# EAGLE design main (EAGLE 6.5.0)
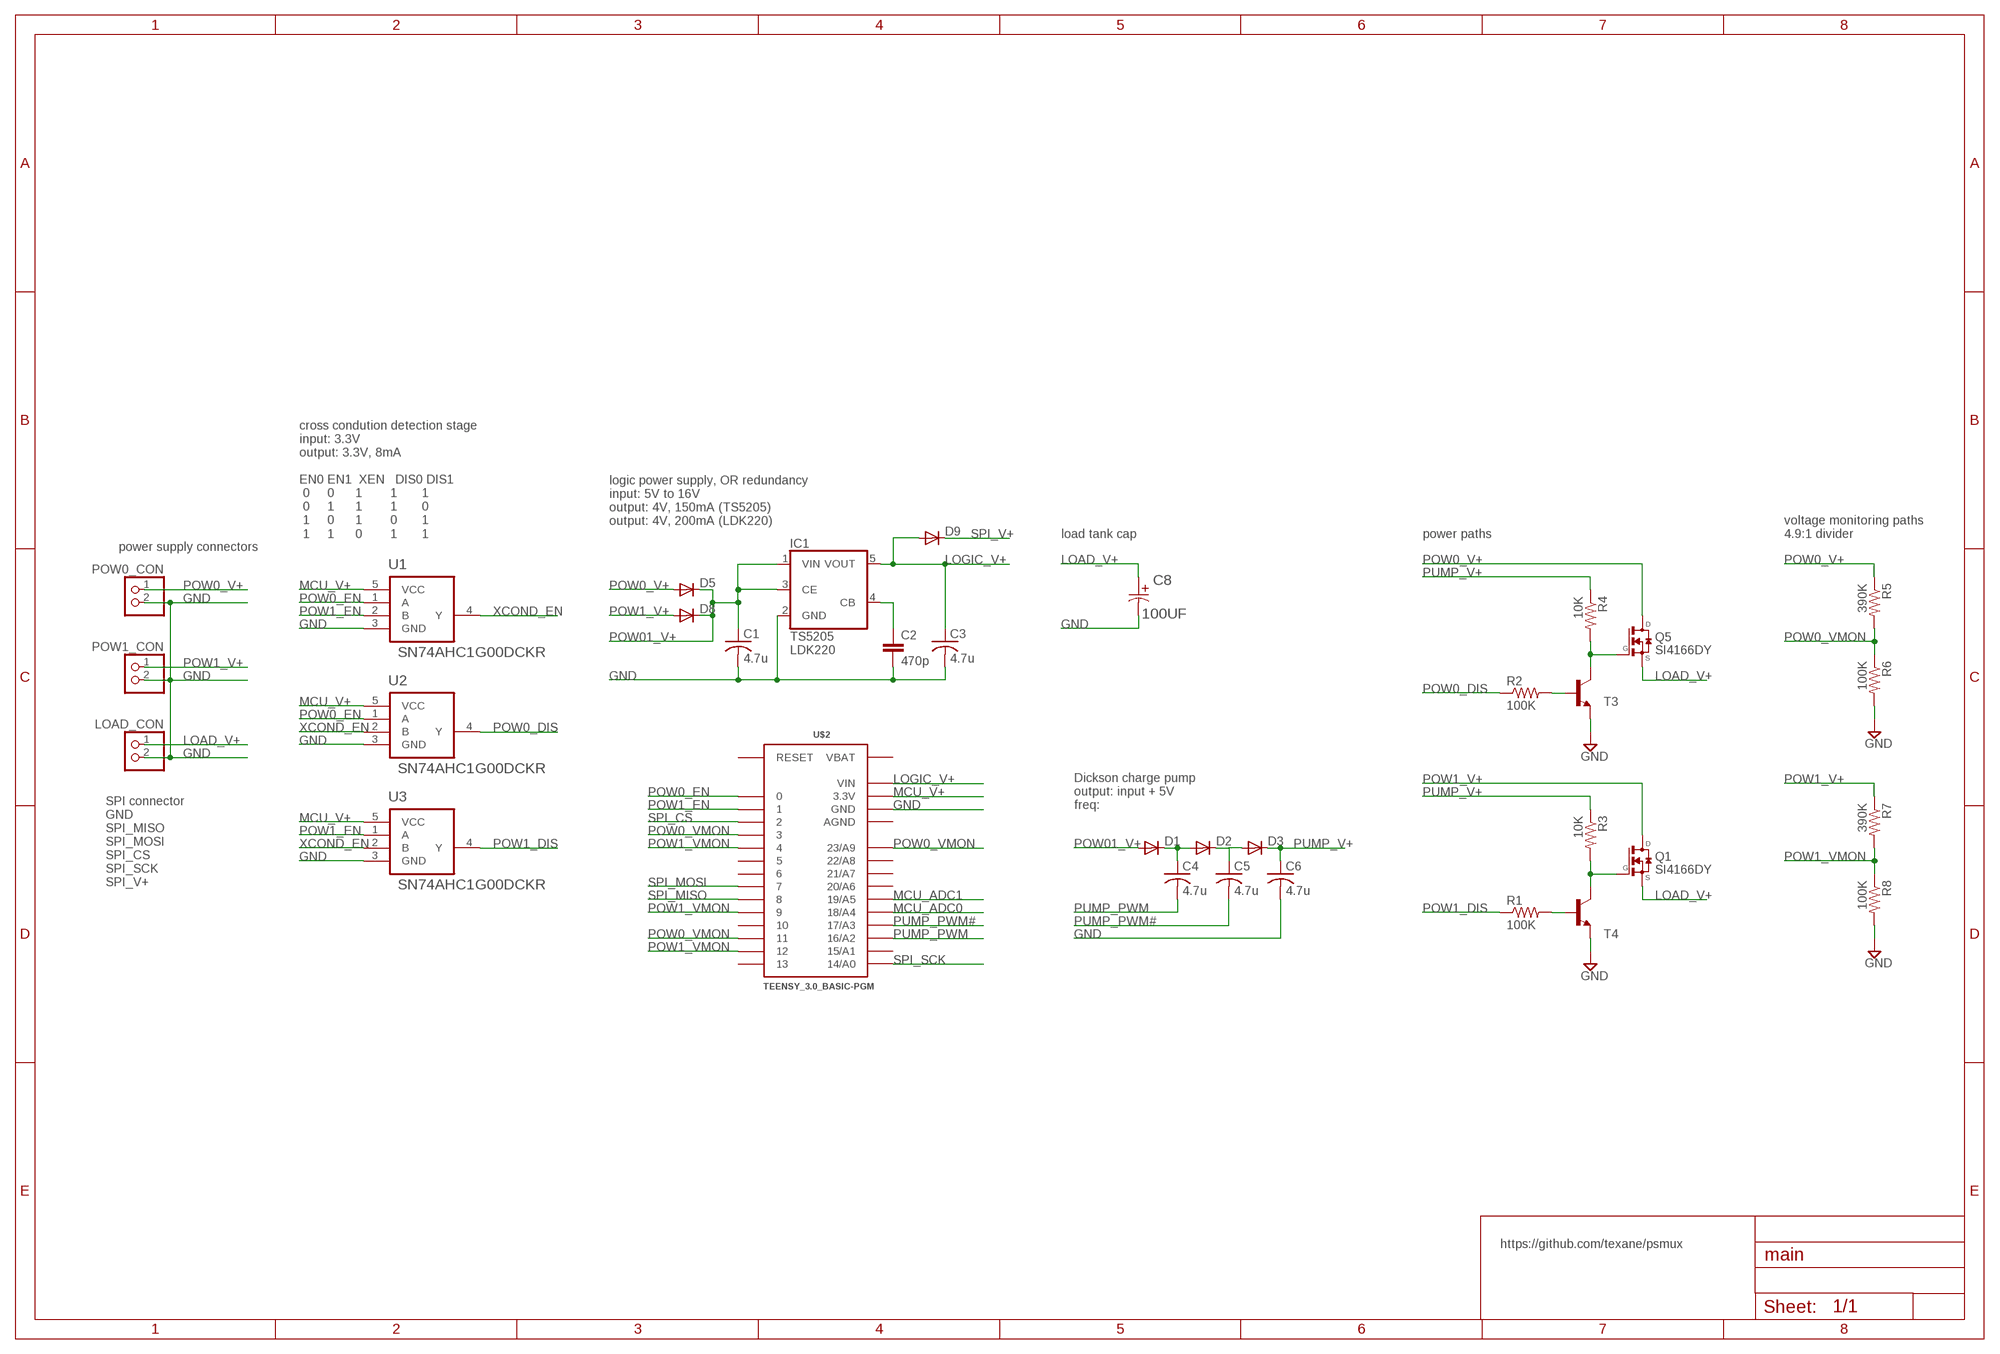
[diagram p0: schematic, sheet 1]

## Parts
C1  4.7u  C-USC1210K  [C1210K]
C2  470p  C-EUC0805K  [C0805K]
C3  4.7u  C-USC1210K  [C1210K]
C4  4.7u  C-USC1210K  [C1210K]
C5  4.7u  C-USC1210K  [C1210K]
C6  4.7u  C-USC1210K  [C1210K]
C8  100UF  EEE-FK1E101XP-CASE-D8  [CAPAE660X800N]
D1  DIODE-DO214AC  [DO214AC]
D2  DIODE-DO214AC  [DO214AC]
D3  DIODE-DO214AC  [DO214AC]
D5  DIODE-DO214AC  [DO214AC]
D8  DIODE-DO214AC  [DO214AC]
D9  DIODE-DO214AC  [DO214AC]
IC1  TS5205  [SOT25]
LOAD_CON  PINHD-1X2  [1X02]
POW0_CON  PINHD-1X2  [1X02]
POW1_CON  PINHD-1X2  [1X02]
Q1  SI4840DY  [SO08-E3]
Q5  SI4840DY  [SO08-E3]
R1  100K  R-US_M0805  [M0805]
R2  100K  R-US_M0805  [M0805]
R3  10K  R-US_M0805  [M0805]
R4  10K  R-US_M0805  [M0805]
R5  390K  R-US_M0805  [M0805]
R6  100K  R-US_M0805  [M0805]
R7  390K  R-US_M0805  [M0805]
R8  100K  R-US_M0805  [M0805]
T3  BC817-40-NPN-SOT23-BEC  [SOT23-BEC]
T4  BC817-40-NPN-SOT23-BEC  [SOT23-BEC]
U1  SN74AHC1G00DCKR  [SOT65P210X110-5N]
U2  SN74AHC1G00DCKR  [SOT65P210X110-5N]
U3  SN74AHC1G00DCKR  [SOT65P210X110-5N]
U$2  TEENSY_3.0_BASIC-PGM  [TEENSY_3.0_BASIC-PGM]

## Nets
GND: C1.2 C2.2 C3.2 C6.2 C8.2 IC1.2(GND) LOAD_CON.2 POW0_CON.2 POW1_CON.2 R6.2 R8.2 T3.E T4.E U1.3(GND) U2.3(GND) U3.3(GND) U$2.GND U$2.GND1(GND)
LOAD_V+: C8.1 LOAD_CON.1 Q1.1-3(S) Q5.1-3(S)
LOGIC_V+: C3.1 D9.A IC1.5(VOUT) U$2.VIN
MCU_ADC0: U$2.18/A4
MCU_ADC1: U$2.19/A5
MCU_V+: U1.5(VCC) U2.5(VCC) U3.5(VCC) U$2.3.3V U$2.3.3V1(3.3V)
N$1: Q5.4(G) R4.2 T3.C
N$2: Q1.4(G) R3.2 T4.C
N$3: R1.2 T4.B
N$4: C4.1 D1.C D2.A
N$5: C5.1 D2.C D3.A
N$6: R2.2 T3.B
N$8: C2.1 IC1.4(CB)
POW0_DIS: R2.1 U2.4(Y)
POW0_EN: U1.1(A) U2.1(A) U$2.0
POW0_V+: D5.A POW0_CON.1 Q5.5-8(D) R5.1
POW0_VMON: R5.2 R6.1 U$2.3 U$2.11 U$2.23/A9
POW1_DIS: R1.1 U3.4(Y)
POW1_EN: U1.2(B) U3.1(A) U$2.1
POW01_V+: C1.1 D1.A D5.C D8.C IC1.1(VIN) IC1.3(CE)
POW1_V+: D8.A POW1_CON.1 Q1.5-8(D) R7.1
POW1_VMON: R7.2 R8.1 U$2.4 U$2.9 U$2.12
PUMP_PWM: C4.2 U$2.16/A2
PUMP_PWM#: C5.2 U$2.17/A3
PUMP_V+: C6.1 D3.C R3.1 R4.1
SPI_CS: U$2.2
SPI_MISO: U$2.8
SPI_MOSI: U$2.7
SPI_SCK: U$2.14/A0
SPI_V+: D9.C
XCOND_EN: U1.4(Y) U2.2(B) U3.2(B)
Unconnected: U$2.5 U$2.6 U$2.10 U$2.13 U$2.15/A1 U$2.20/A6 U$2.21/A7 U$2.22/A8 U$2.RESET

## Notes on the sheet
- logic power supply, OR redundancy
  input: 5V to 16V
  output: 4V, 150mA (TS5205)
  output: 4V, 200mA (LDK220)
- cross condution detection stage
  input: 3.3V
  output: 3.3V, 8mA
  
  EN0 EN1  XEN   DIS0 DIS1
   0     0      1        1       1 
   0     1      1        1       0  
   1     0      1        0       1
   1     1      0        1       1
- load tank cap | power paths
- voltage monitoring paths
  4.9:1 divider
- power supply connectors
- TS5205
  LDK220
- SI4166DY
- Dickson charge pump
  output: input + 5V
  freq:
- SI4166DY
- SPI connector
  GND
  SPI_MISO
  SPI_MOSI
  SPI_CS
  SPI_SCK
  SPI_V+
- https://github.com/texane/psmux

## Power pins joined to a net without a drawn wire
AGND: U$2.AGND
VBAT: U$2.VBAT

## Library data of the parts
C1 C3-C6 = rcl:C-US: CAPACITOR, American symbol
C2 = rcl:C-EU: CAPACITOR, European symbol
C8 = Panasonic-EEEFK_EEEFP:EEE-: Aluminum Electrolytic Capacitors,Surface Mount Type; MPN: EEE-FK1E101XP; OC_FARNELL: 1850109; OC_NEWARK: 23T0852; PACKAGE: CASE-D8; SUPPLIER: PANASONIC; TOLERANCE: ±20 %; VOLTAGERATING: 25V
D1-D3 D5 D8 D9 = diode:DIODE-: DIODE
IC1 = v-reg:TS5205: 150mA Low Noise LDO Voltage Regulator with Enable TSC [Taiwan Semiconductor Company, Ltd] Source: http://www.taiwansemi.com .. 5205_0409c.pdf
LOAD_CON POW0_CON POW1_CON = pinhead:PINHD-1X2: PIN HEADER
Q1 Q5 = transistor-fet:SI4840DY: N-Channel MOSFET
R1-R8 = resistor:R-US_: RESISTOR, American symbol
T3 T4 = transistor:*-NPN-: NPN Transistror BF959 corrected 2008.03.06
U1-U3 = TI-SN74AHC1G00DCKR@E:SN74AHC1G00DCKR: SINGLE 2-INPUT POSITIVE-NAND GATE; MPN: SN74AHC1G00DCKR; OC_FARNELL: 1287496; OC_NEWARK: 26M3221; PACKAGE: SC70-5; SUPPLIER: Texas Instruments
U$2 = Teensy3.0:TEENSY_3.0_BASIC-PGM: Teensy 3.0 Board outline identical to other 'basic' version except that 'PGM' pin has been omitted. See '+4', 'AllAnalogPins", and 'AllPins' packages for additional pin holes, as needed.

## Board
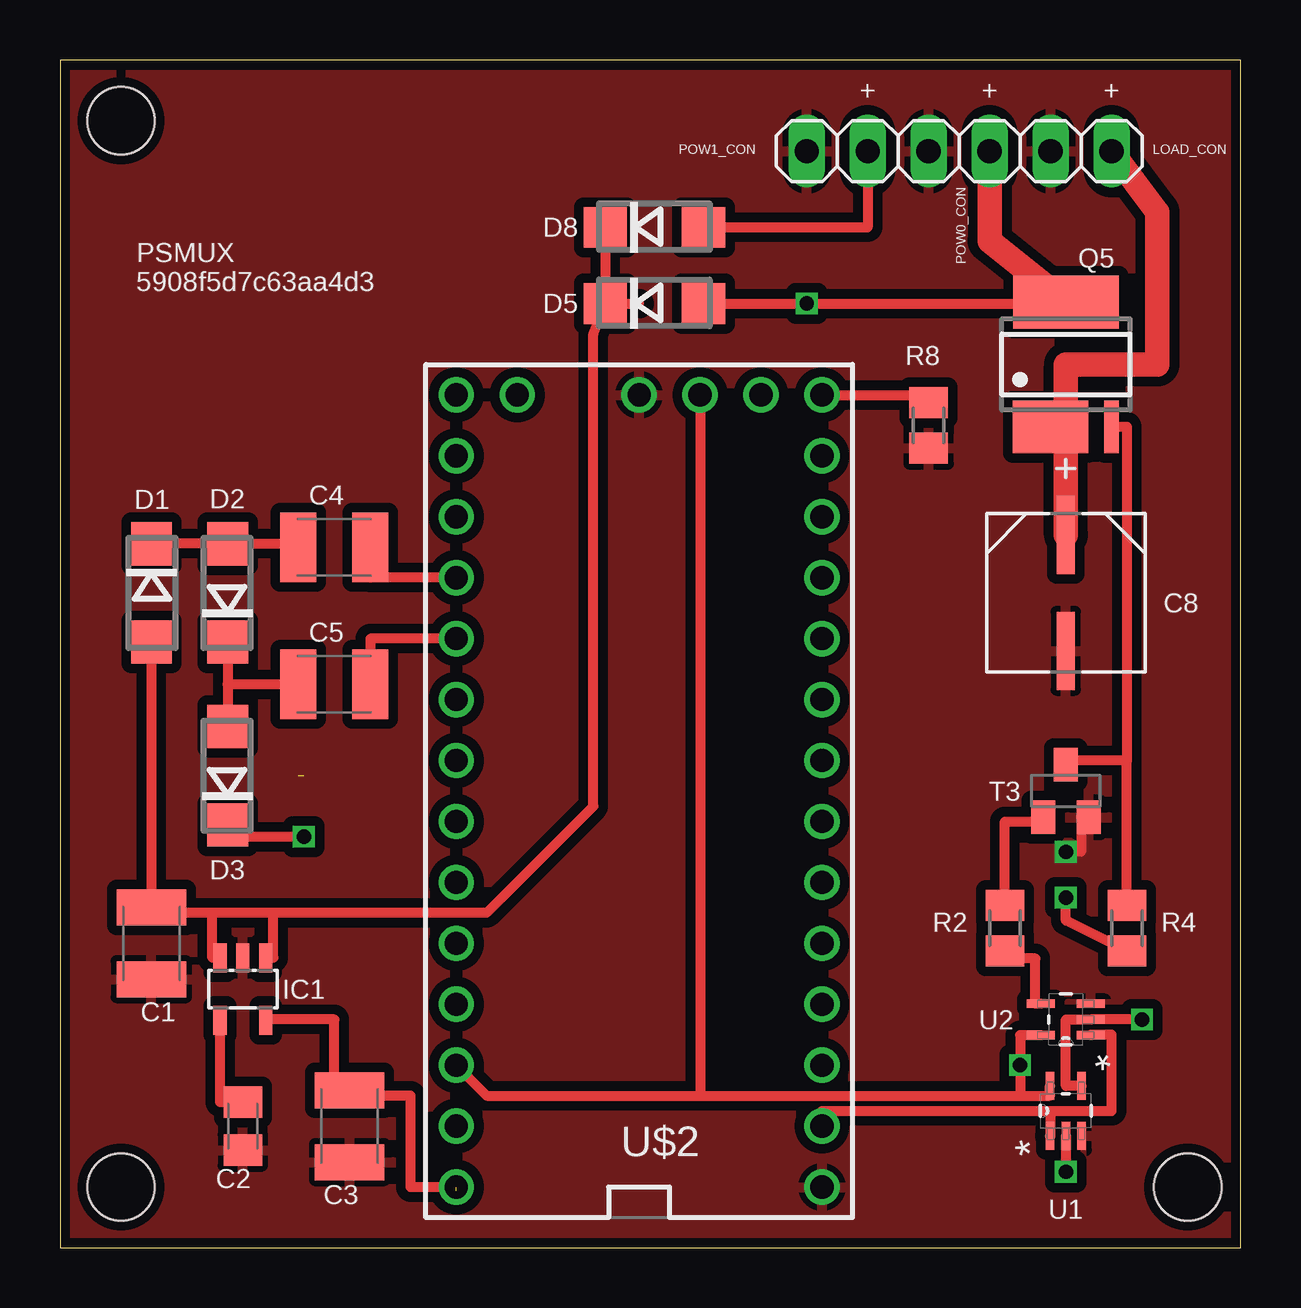
[diagram p1: board, top side]
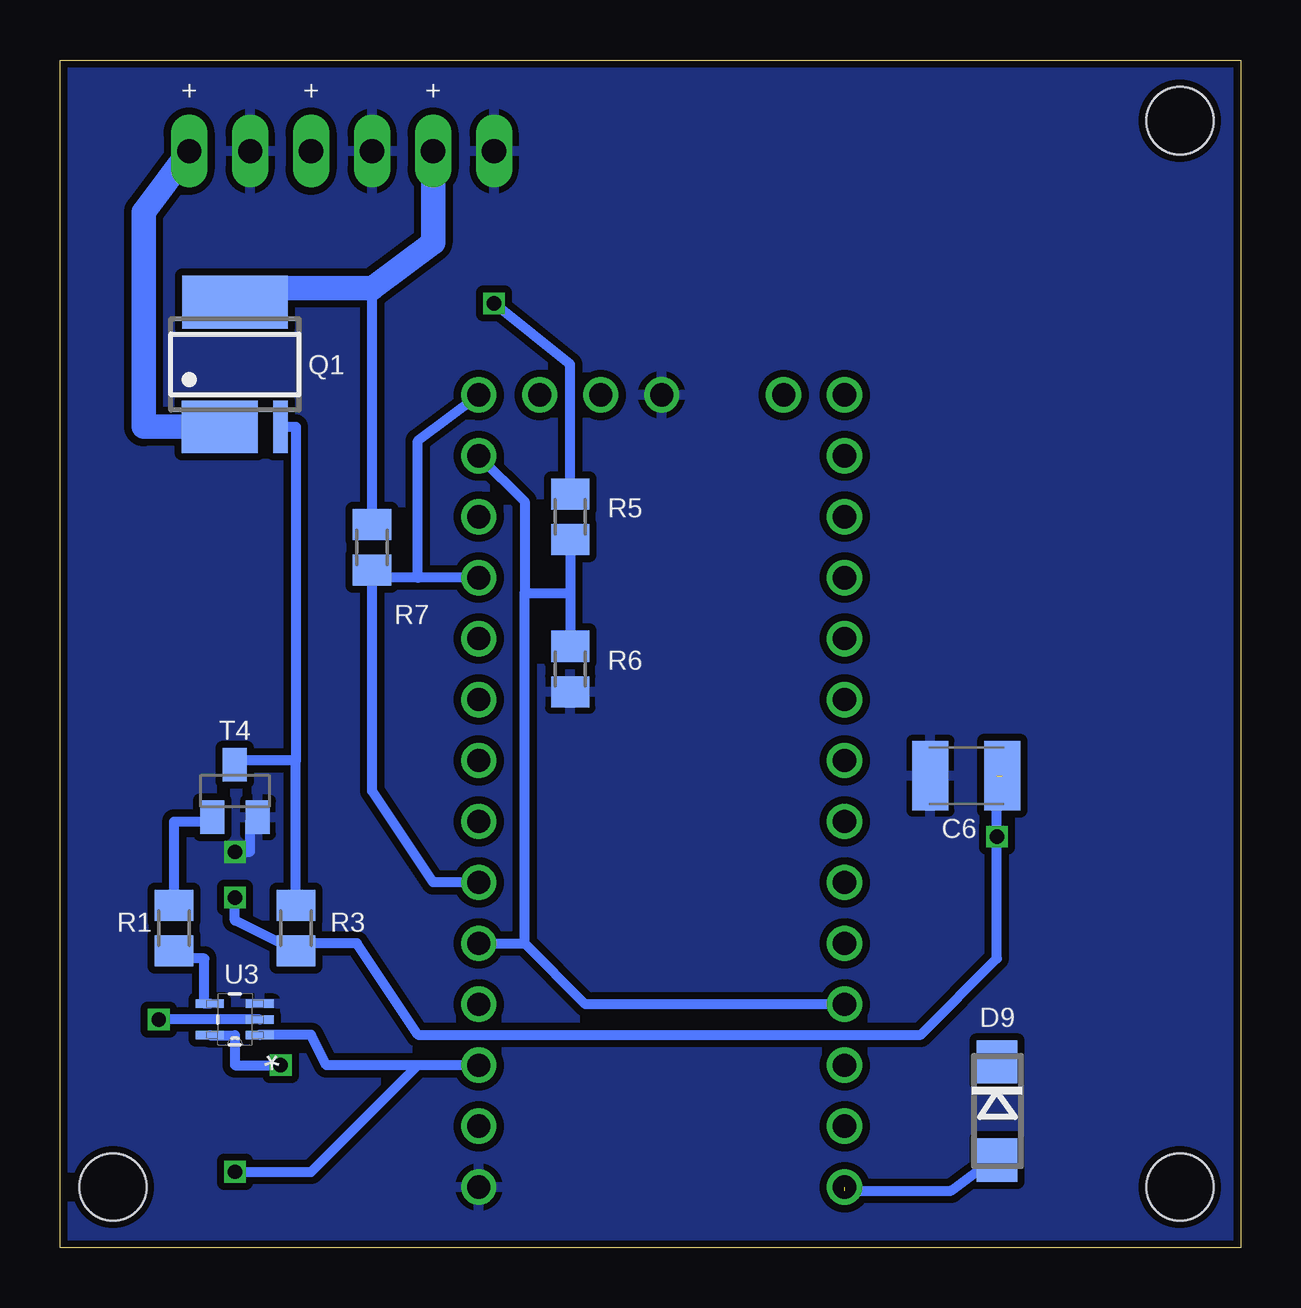
[diagram p2: board, bottom side, seen from below]

Size 49.2 x 49.52 mm. Coordinates in mm from the lower left corner, seen from the top.
Outline: 0,0 49.2,0 49.2,49.52 0,49.52 0,0
Copper layers (1*16): Top 0.035mm / dielectric 1.5mm / Bottom 0.035mm
Design rules "SeeedStudio_2layer_DRU_no_angle_20140221": minimum track width 6mil, minimum drill 12mil, track to track 6mil, track to pad 6mil, pad to pad 6mil, via to via 6mil, smd to smd 0mil, copper to edge 10mil, drill to drill 10mil, minimum pad ring 10mil, minimum via ring 6mil, stop-mask expansion 2mil, vias tented up to drill 100mil, thermal gap 10mil
Holes 2.8 mm at 46.99,2.54 2.54,2.54 2.54,46.99

### Footprints (pad centres in the part's own frame; a part is rotated, then mirrored left to right if it is on the bottom)
C1210K = smd 1.5 x 2.9: 1 -1.5,0; 2 1.5,0
C0805K = smd 1.3 x 1.6: 1 -1,0; 2 1,0
CAPAE660X800N = smd 3.251 x 0.762: 1 -2.413,0; 2 2.413,0
DO214AC = smd 1.8 x 1.7: A 2.05,0; C -2.05,0
SOT25 = smd 0.55 x 1.2: 1 -0.95,-1.3; 2 0,-1.3; 3 0.95,-1.3; 4 0.95,1.3; 5 -0.95,1.3
1X02 = drill 1.016 long: 1 -1.27,0; 2 1.27,0
SO08-E3 = smd 3.15 x 2.2: 1-3 -0.635,-2.6 | smd 0.6 x 2.2: 4 1.905,-2.6 | smd 4.4 x 2.2: 5-8 0,2.6
M0805 = smd 1.3 x 1.6: 1 -0.95,0; 2 0.95,0
SOT23-BEC = smd 1 x 1.4: B -0.95,-1.1; C 0,1.1; E 0.95,-1.1
SOT65P210X110-5N = smd 1.168 x 0.356: 1 -1.041,0.66; 2 -1.041,0; 3 -1.041,-0.66; 4 1.041,-0.66; 5 1.041,0.66
TEENSY_3.0_BASIC-PGM = drill 0.965: 0 -7.62,13.97; 1 -7.62,11.43; 2 -7.62,8.89; 3 -7.62,6.35; 3.3V 7.62,11.43; 3.3V1 -2.54,-16.51; 4 -7.62,3.81; 5 -7.62,1.27; 6 -7.62,-1.27; 7 -7.62,-3.81; 8 -7.62,-6.35; 9 -7.62,-8.89; 10 -7.62,-11.43; 11 -7.62,-13.97; 12 -7.62,-16.51; 13 7.62,-16.51; 14/A0 7.62,-13.97; 15/A1 7.62,-11.43; 16/A2 7.62,-8.89; 17/A3 7.62,-6.35; 18/A4 7.62,-3.81; 19/A5 7.62,-1.27; 20/A6 7.62,1.27; 21/A7 7.62,3.81; 22/A8 7.62,6.35; 23/A9 7.62,8.89; AGND 7.62,13.97; GND -7.62,16.51; GND1 0,-16.51; RESET 5.08,-16.51; VBAT -5.08,-16.51; VIN 7.62,16.51

### Placement (x,y rotation side)
C1  3.81,12.7 270 top
C2  7.62,5.08 270 top
C3  12.06,5.08 270 top
C4  11.43,29.21 0 top
C5  11.43,23.5 0 top
C6  11.43,19.68 180 bottom
C8  41.91,27.3 270 top
D1  3.81,27.3 270 top
D2  6.99,27.3 90 top
D3  6.99,19.68 90 top
D5  24.77,39.37 0 top
D8  24.77,42.55 0 top
D9  10.16,5.71 270 bottom
IC1  7.62,10.79 180 top
LOAD_CON  42.55,45.72 180 top
POW0_CON  37.47,45.72 180 top
POW1_CON  32.38,45.72 180 top
Q1  41.91,36.83 0 bottom
Q5  41.91,36.83 0 top
R1  44.45,13.34 90 bottom
R2  39.37,13.34 90 top
R3  39.37,13.34 90 bottom
R4  44.45,13.34 90 top
R5  27.94,30.48 270 bottom
R6  27.94,24.13 270 bottom
R7  36.2,29.21 270 bottom
R8  36.2,34.29 270 top
T3  41.91,19.05 0 top
T4  41.91,19.05 0 bottom
U1  41.91,5.71 90 top
U2  41.91,9.53 180 top
U3  41.91,9.53 180 bottom
U$2  24.13,19.05 180 top

### Tracks (layer width: path | path; a pad name or v marks a point on that pad's centre or on a via)
GND  (via drill 0.6)
  Top 0.406: T3.E 42.55,17.95 42.55,16.51 v41.91,16.51
  Bottom 0.406: v41.91,16.51 41.27,16.51 41.27,17.78 40.96,17.78 T4.E
  pour Top (isolate 0.406): -0.64,49.53 49.53,49.53 49.53,0 0,0
  pour Bottom (isolate 0.305): -0.64,49.53 49.53,49.53 49.53,0 0,0
LOAD_V+
  Top 0.406: 41.91,36.77 41.91,36.83 | Q5.1-3 41.91,34.23 41.91,34.29
  Top 1.016: C8.1 41.91,34.29 41.91,36.77 | LOAD_CON.1 45.72,43.18 45.72,36.83 41.91,36.83
  Bottom 1.016: Q1.1-3 45.72,34.23 45.72,43.18 LOAD_CON.1
LOGIC_V+  (1 unrouted)
  Top 0.406: U$2.VIN 14.61,2.54 14.61,6.35 12.06,6.35 C3.1 11.43,6.58 11.43,9.53 8.57,9.53 IC1.5
  Bottom 0.406: 16.51,2.4 12.06,2.4 10.16,3.81 D9.A
MCU_V+  (via drill 0.6)
  Top 0.406: U$2.3.3V 17.78,6.35 26.67,6.35 | 26.67,6.35 40.01,6.35 | 40.01,6.35 41.25,6.35 U1.5 | U2.5 40.01,8.87 v40.01,7.62 40.01,6.35 | U$2.3.3V1 26.67,6.35
  Bottom 0.406: U3.5 41.91,8.87 41.91,7.62 v40.01,7.62
N$1
  Top 0.406: R4.2 44.45,20.32 | 44.45,20.32 41.91,20.32 T3.C | Q5.4 44.45,34.23 44.45,20.32
N$2
  Bottom 0.406: R3.2 39.37,20.32 | 39.37,20.32 41.91,20.32 T4.C | Q1.4 39.37,34.23 39.37,20.32
N$3
  Bottom 0.406: R1.2 44.45,17.78 42.86,17.78 T4.B
N$4
  Top 0.406: D1.C D2.A 9.93,29.36 C4.1
N$5
  Top 0.406: D2.C 6.99,23.5 | 6.99,23.5 D3.A | C5.1 6.99,23.5
N$6
  Top 0.406: R2.2 39.37,17.78 40.96,17.78 T3.B
N$8
  Top 0.406: C2.1 6.67,6.08 IC1.4
POW0_DIS
  Top 0.406: U2.4 40.64,10.19 40.64,12.06 39.37,12.06 R2.1
POW0_EN
  Top 0.406: U$2.0 31.75,5.71 41.27,5.71 | 41.27,5.71 43.81,5.71 43.81,8.89 42.95,8.89 U2.1 | U1.1 41.27,4.67 41.27,5.71
POW0_V+  (via drill 0.6)
  Top 0.406: D5.A v31.11,39.37 41.24,39.37 41.24,39.96 | Q5.5-8 41.91,39.37
  Top 1.016: POW0_CON.1 38.73,41.97 41.24,39.96 Q5.5-8
  Bottom 0.406: R5.1 27.94,36.83 v31.11,39.37
POW0_VMON
  Bottom 0.406: U$2.11 29.84,31.11 29.84,27.3 | 29.84,27.3 27.94,27.3 | R5.2 27.94,27.3 | 27.94,27.3 R6.1 | U$2.3 29.84,12.7 | 29.84,12.7 29.84,27.3 | U$2.23/A9 27.3,10.16 29.84,12.7
POW1_DIS
  Bottom 0.406: U3.4 43.18,10.19 43.18,12.06 44.45,12.06 R1.1
POW1_EN  (via drill 0.6)
  Top 0.406: U1.2 v41.91,3.17
  Bottom 0.406: U$2.1 34.29,7.62 | U3.1 40.87,8.89 38.73,8.89 38.1,7.62 34.29,7.62 | v41.91,3.17 38.73,3.17 34.29,7.62
POW01_V+
  Top 0.406: D8.C D5.C | D5.C 24.13,39.37 | 8.89,13.97 17.78,13.97 22.23,18.41 22.23,38.1 D5.C | 8.89,13.97 6.35,13.97 | IC1.1 8.89,12.1 8.89,13.97 | IC1.3 6.35,12.1 6.35,13.97 | D1.A C1.1 3.81,13.97 6.35,13.97
POW1_V+
  Top 0.406: POW1_CON.1 33.66,42.55 D8.A
  Bottom 0.406: R7.1 36.2,40.01
  Bottom 1.016: POW1_CON.1 33.66,41.91 36.2,40.01 41.91,40.01 Q1.5-8
POW1_VMON
  Top 0.406: U$2.12 36.2,35.56 R8.1
  Bottom 0.406: U$2.4 33.66,15.24 36.2,19.05 R7.2 36.2,27.94 34.29,27.94 | U$2.9 34.29,27.94 | 34.29,27.94 34.29,33.66 U$2.12
PUMP_PWM
  Top 0.406: U$2.16/A2 12.93,27.94 C4.2
PUMP_PWM#
  Top 0.406: U$2.17/A3 12.93,25.4 C5.2
PUMP_V+  (via drill 0.6)  (1 unrouted)
  Top 0.406: v10.16,17.14 6.99,17.14 D3.C | R4.1 41.91,13.65 v41.91,14.61
  Bottom 0.406: v41.91,14.61 41.91,13.65 R3.1 39.37,12.7 36.83,12.7 34.29,8.89 13.34,8.89 10.16,12.06 v10.16,17.14 10.16,19.68
XCOND_EN  (via drill 0.6)
  Top 0.406: v45.09,9.53 U2.2 41.91,9.53 41.91,6.76 U1.4
  Bottom 0.406: U3.2 v45.09,9.53

### Text on the board
tNames: + | + | + | PSMUX / 5908f5d7c63aa4d3
bNames: + | + | +